# Altium project 28Pins_Project_V1I1.PrjPCB (part 1 of 3)
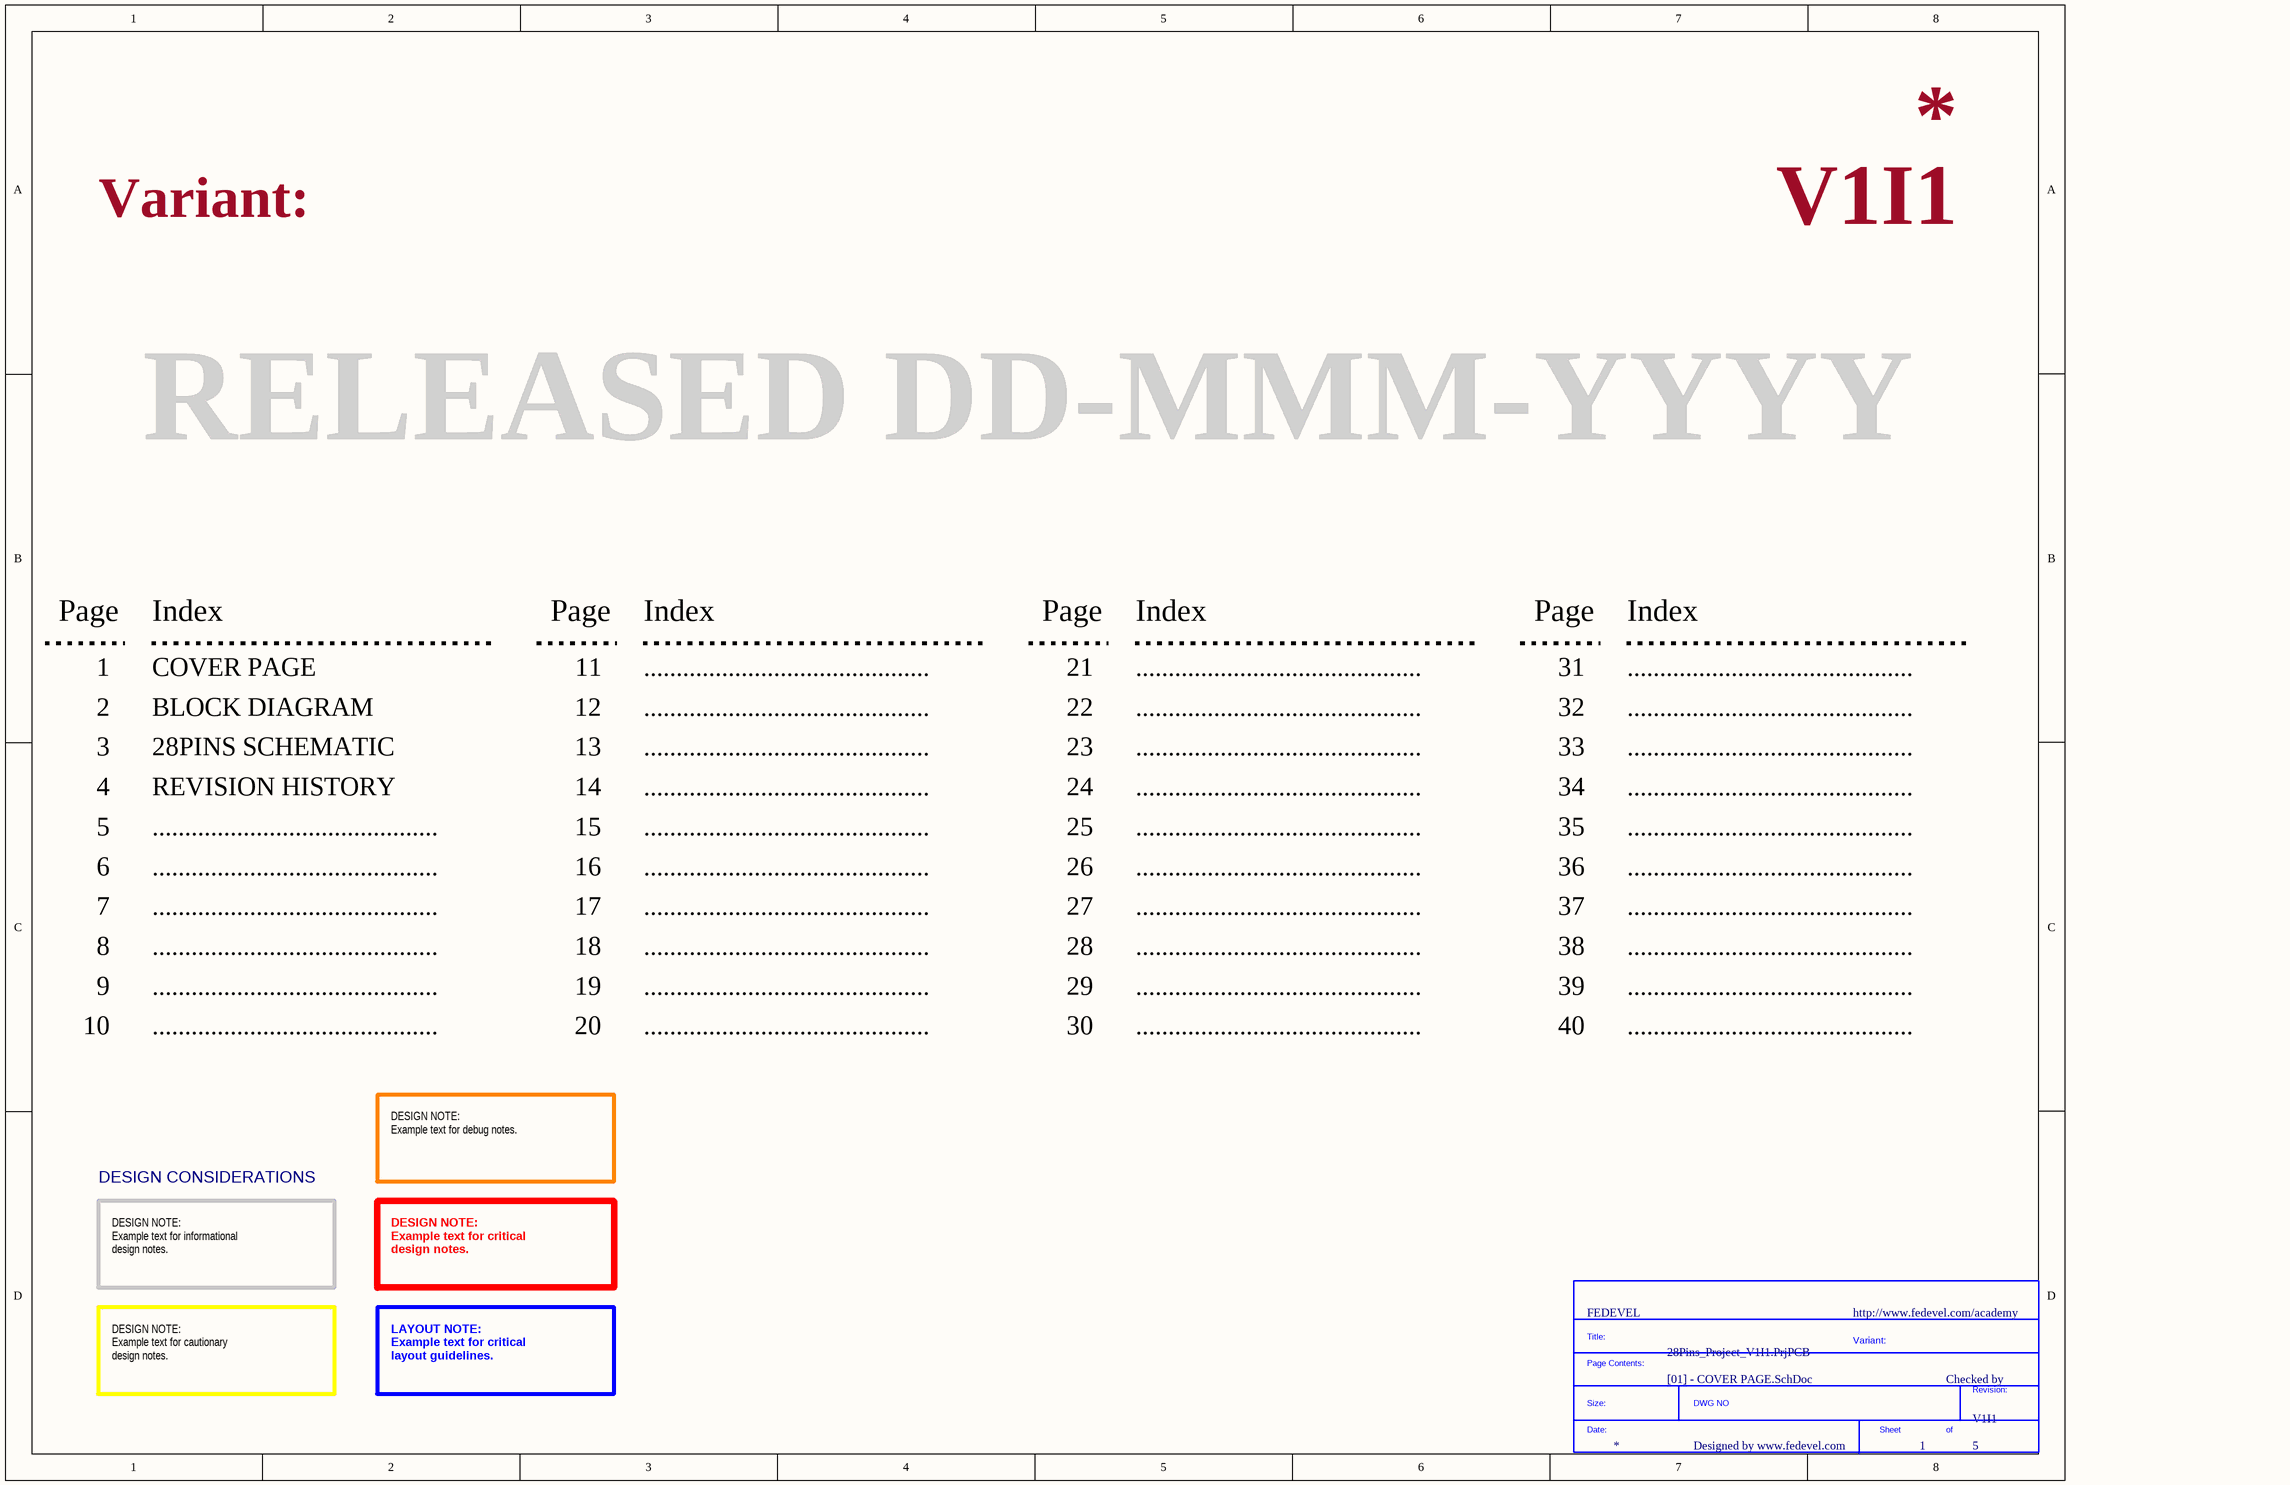
[diagram p0: [01] - COVER PAGE.SchDoc]
=CompanyName: FEDEVEL; NotFitted: NF; Title: 28Pins; VersionRevision: V1I1
4 sheets, 113 parts. Net scope: global (net labels, ports and power ports of the same name join across sheets).
Board file: 28Pins_Project_V1I1_PCB.PcbDoc
Sheets:
  [01] - COVER PAGE.SchDoc
  [02] - BLOCK DIAGRAM.SchDoc
  [03] - 28PINS SCHEMATIC.SchDoc
  [04] - REVISION HISTORY.SchDoc

## Sheet [01] - COVER PAGE.SchDoc: 28Pins
size A3; DocumentNumber: 1; SheetNumber: 1; SheetTotal: 5

### Parts
(Parts that share a designator on the sheet are numbered #1, #2 ... from top to bottom, then left to right.)
*#1  SDTitleBlock  (value not drawn)  (graphical)

### Notes on the sheet
- Variant:
- RELEASED DD-MMM-YYYY
- Page
- Index
- 1
- COVER PAGE
- 11
- ............................................
- 21
- 31
- 2
- 3
- BLOCK DIAGRAM
- 28PINS SCHEMATIC
- 12
- 13
- 22
- 23
- 32
- 33
- 4
- 5
- REVISION HISTORY
- 14
- 15
- 24
- 25
- 34
- 35
- 6
- 16
- 26
- 36
- 7
- 8
- 17
- 18
- 27
- 28
- 37
- 38
- 9
- 10
- 19
- 20
- 29
- 30
- 39
- 40
- DESIGN NOTE:
  Example text for debug notes.
- DESIGN CONSIDERATIONS
- DESIGN NOTE:
  Example text for informational
  design notes.
- DESIGN NOTE:
  Example text for critical
  design notes.
- http://www.fedevel.com/academy
- DESIGN NOTE:
  Example text for cautionary
  design notes.
- LAYOUT NOTE:
  Example text for critical
  layout guidelines.
- Checked by
- Designed by www.fedevel.com
- (in symbol SDTitleBlock) Title:; Page Contents:; Revision:; Size:; DWG NO; Date:; Sheet; of

## Sheet [02] - BLOCK DIAGRAM.SchDoc: 28Pins
size A3; DocumentNumber: 2; SheetNumber: 2; SheetTotal: 5; PageSetup: Record=PageOptions|CenterHorizontal=True|CenterVertical=True|PrintScale=0.52|XCorrection=1.00|YCorrection=1.00|PrintKind=1|BorderSize=5000000|LeftOffset=0|BottomOffset=0|Orientation=2|PaperLength=1000|PaperWidth=1000|Scale=100|PaperSource=4|PrintQuality=600|MediaType=1|DitherType=10|PrintScaleMode=1|PaperKind=A4|PaperIndex=9
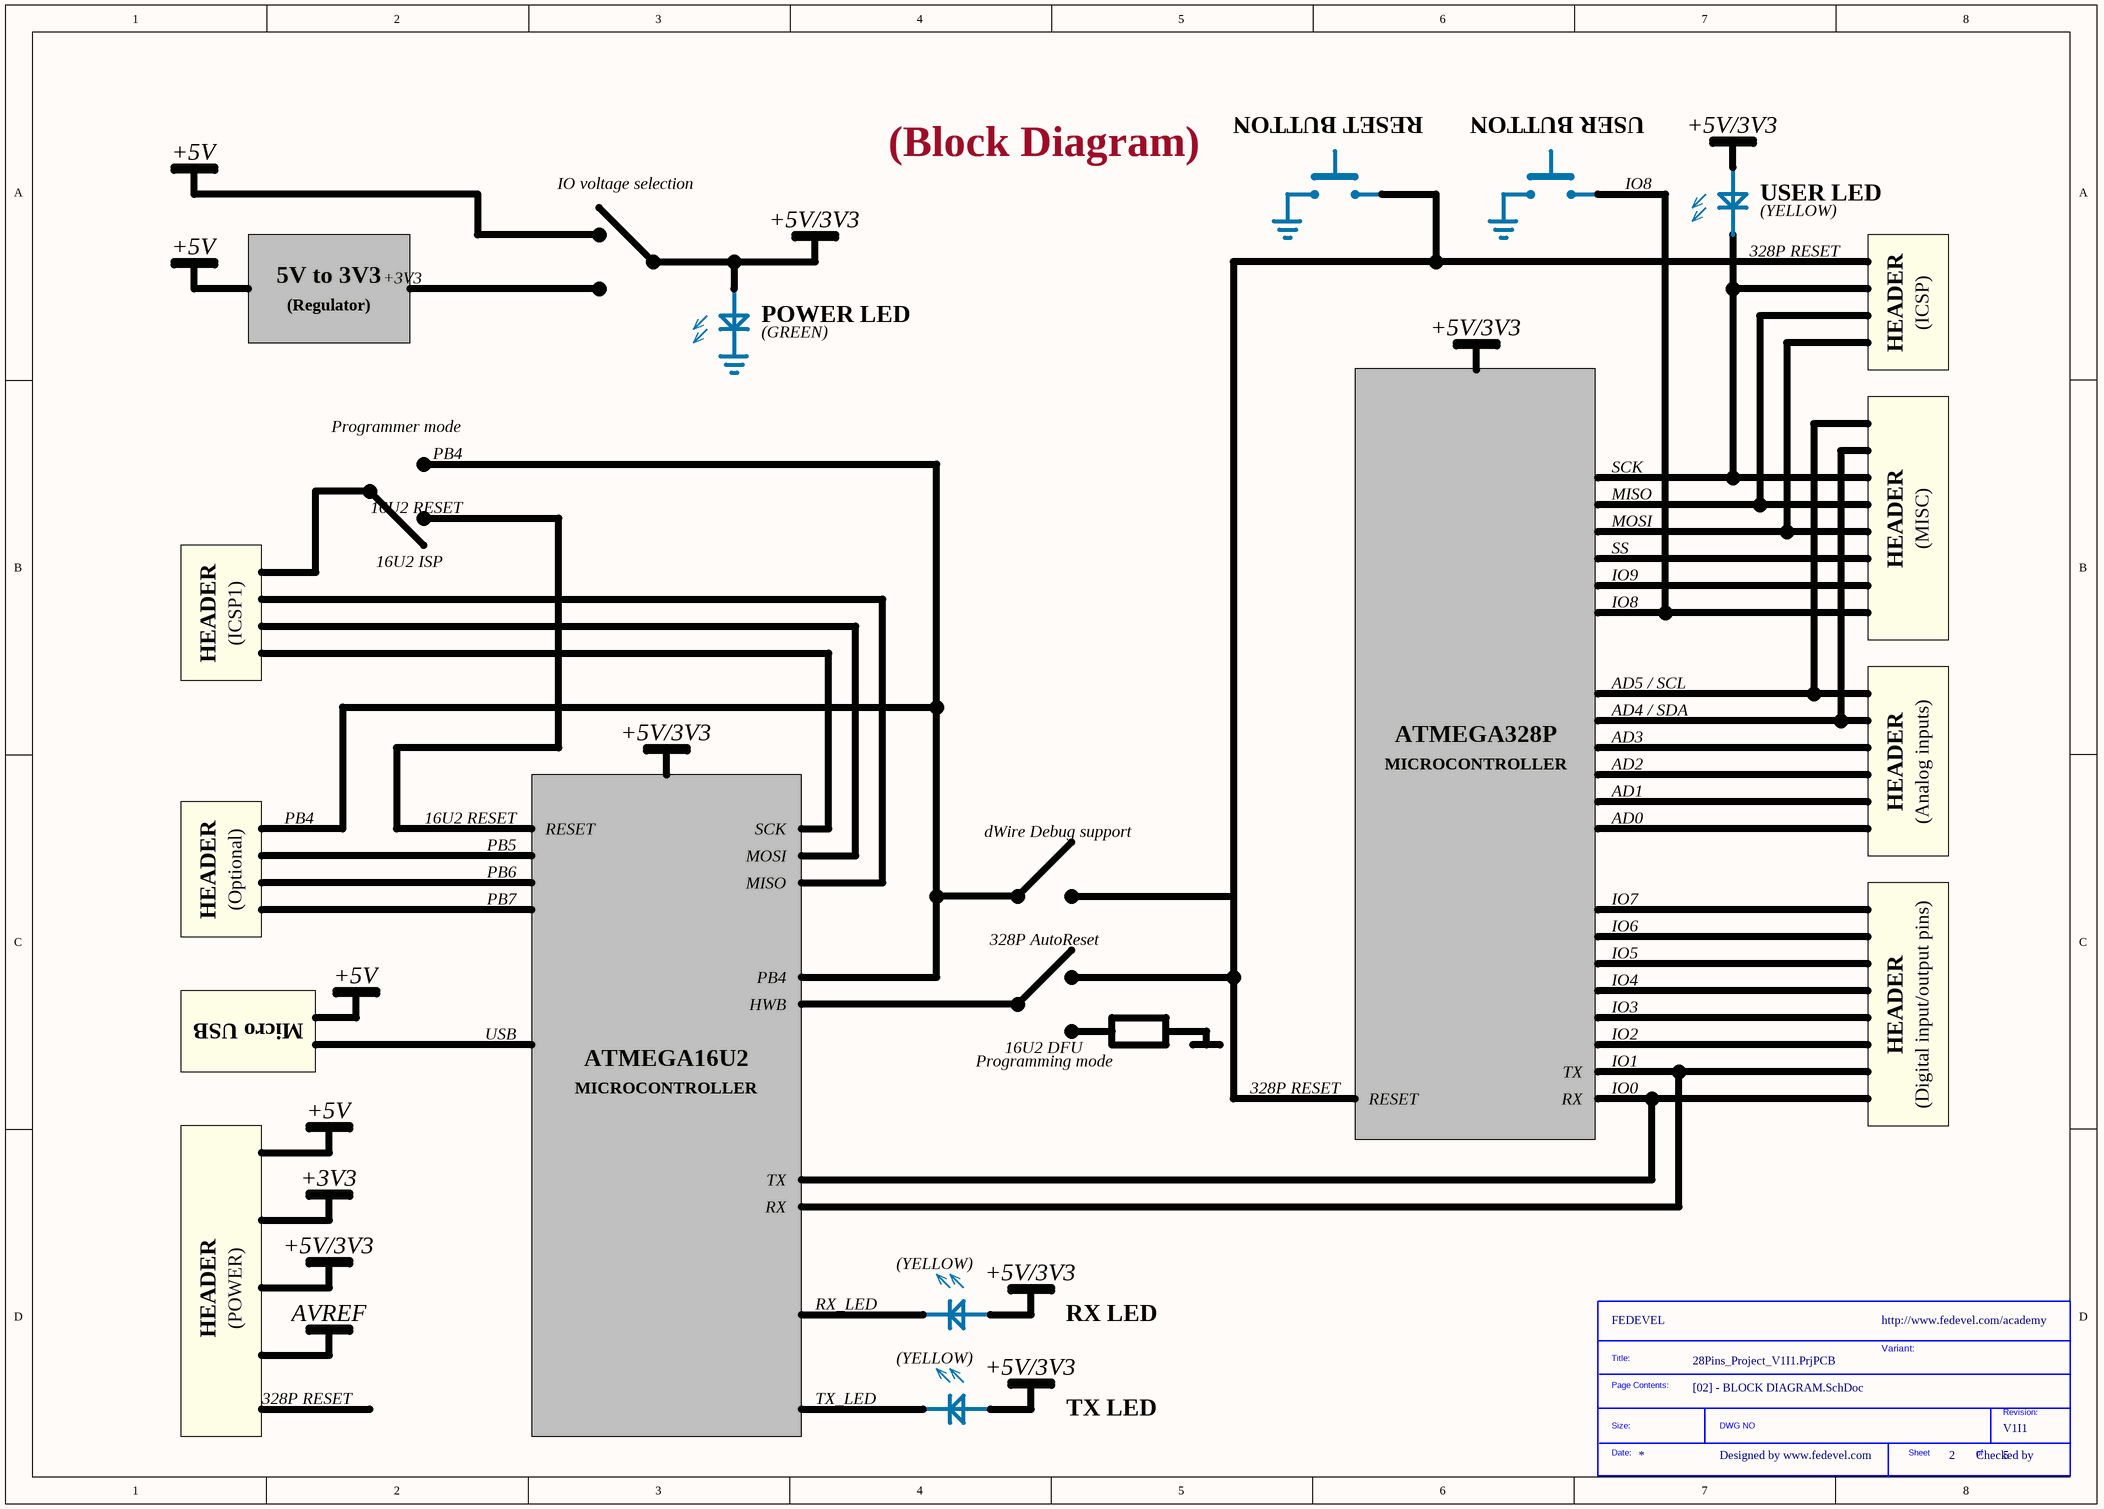
[diagram p1: [02] - BLOCK DIAGRAM.SchDoc]

### Parts
(Parts that share a designator on the sheet are numbered #1, #2 ... from top to bottom, then left to right.)
*#2  SDTitleBlock  (value not drawn)  (graphical)

### Notes on the sheet
- +5V
- (Block Diagram)
- RESET BUTTON
- USER BUTTON
- +5V/3V3
- IO voltage selection
- IO8
- USER LED
- (YELLOW)
- 5V to 3V3
- (Regulator)
- +3V3
- 328P RESET
- HEADER
- (ICSP)
- POWER LED
- (GREEN)
- Programmer mode
- PB4
- 16U2 RESET
- MISO
- SCK
- (MISC)
- 16U2 ISP
- SS
- IO9
- MOSI
- (ICSP1)
- AD5 / SCL
- AD4 / SDA
- ATMEGA328P
- MICROCONTROLLER
- AD3
- AD2
- (Analog inputs)
- PB5
- RESET
- dWire Debug support
- AD1
- AD0
- (Optional)
- PB6
- PB7
- IO7
- 328P AutoReset
- IO6
- IO5
- IO4
- Micro USB
- USB
- ATMEGA16U2
- HWB
- 16U2 DFU
- IO3
- IO2
- (Digital input/output pins)
- Programming mode
- RX
- TX
- IO1
- IO0
- (POWER)
- AVREF
- RX_LED
- RX LED
- http://www.fedevel.com/academy
- Variant:
- TX_LED
- TX LED
- Designed by www.fedevel.com
- Checked by
- (in symbol SDTitleBlock) Title:; Page Contents:; Revision:; Size:; DWG NO; Date:; Sheet; of

## Sheet [03] - 28PINS SCHEMATIC.SchDoc: 28Pins
size A2; DocumentNumber: 3; SheetNumber: 3; SheetTotal: 5
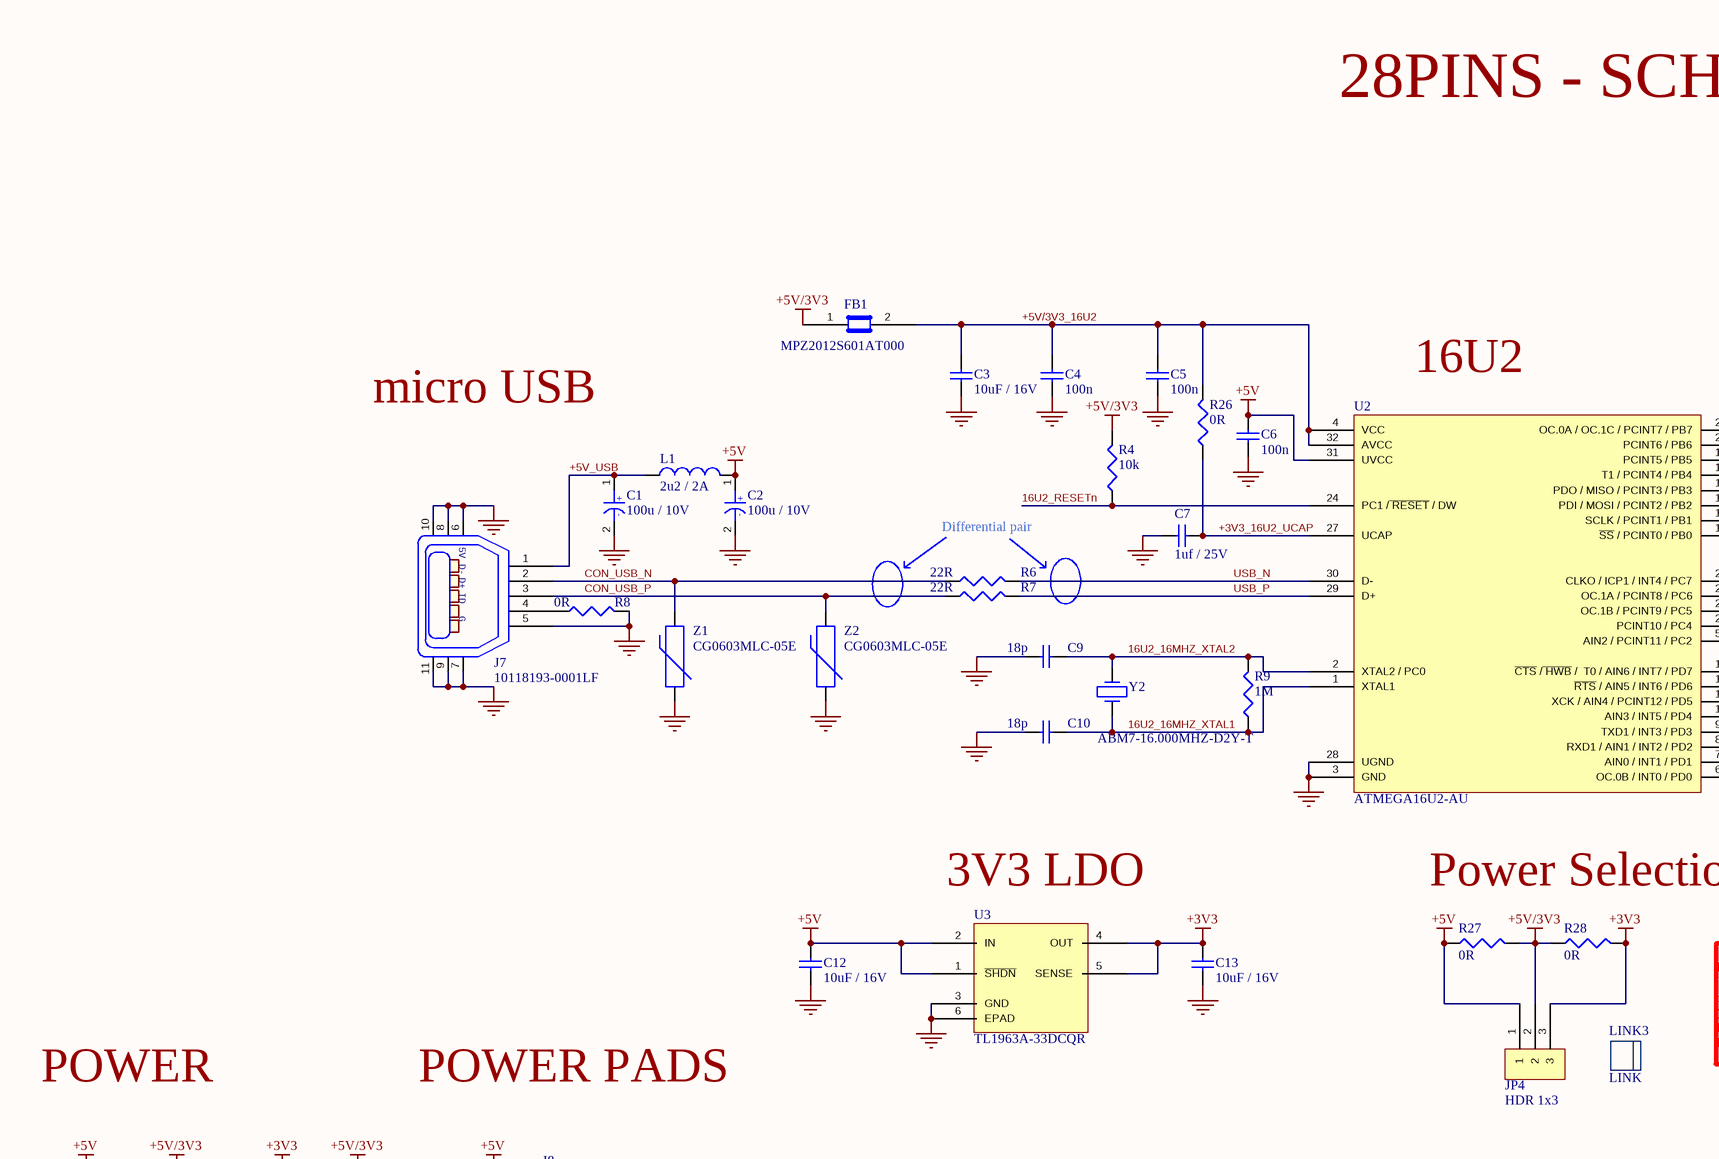
[diagram p2: [03] - 28PINS SCHEMATIC.SchDoc, top left]
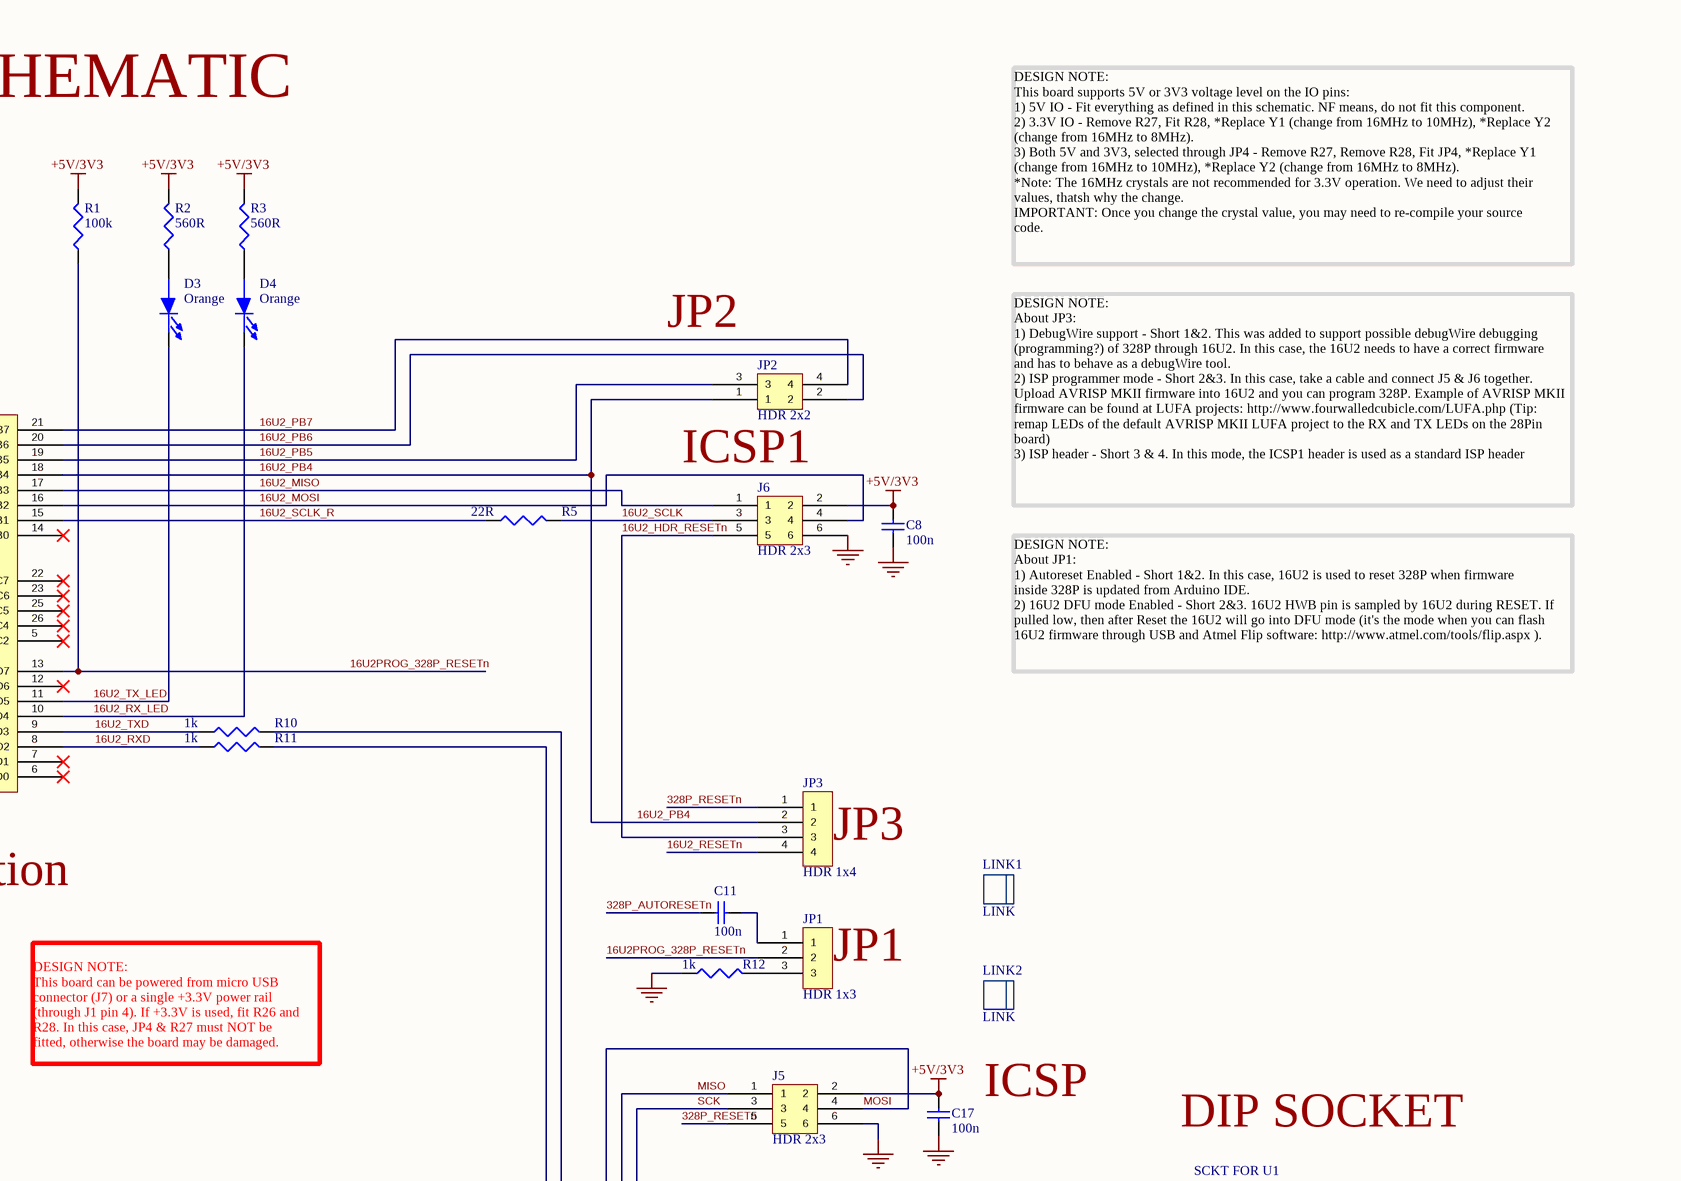
[diagram p3: [03] - 28PINS SCHEMATIC.SchDoc, top right]
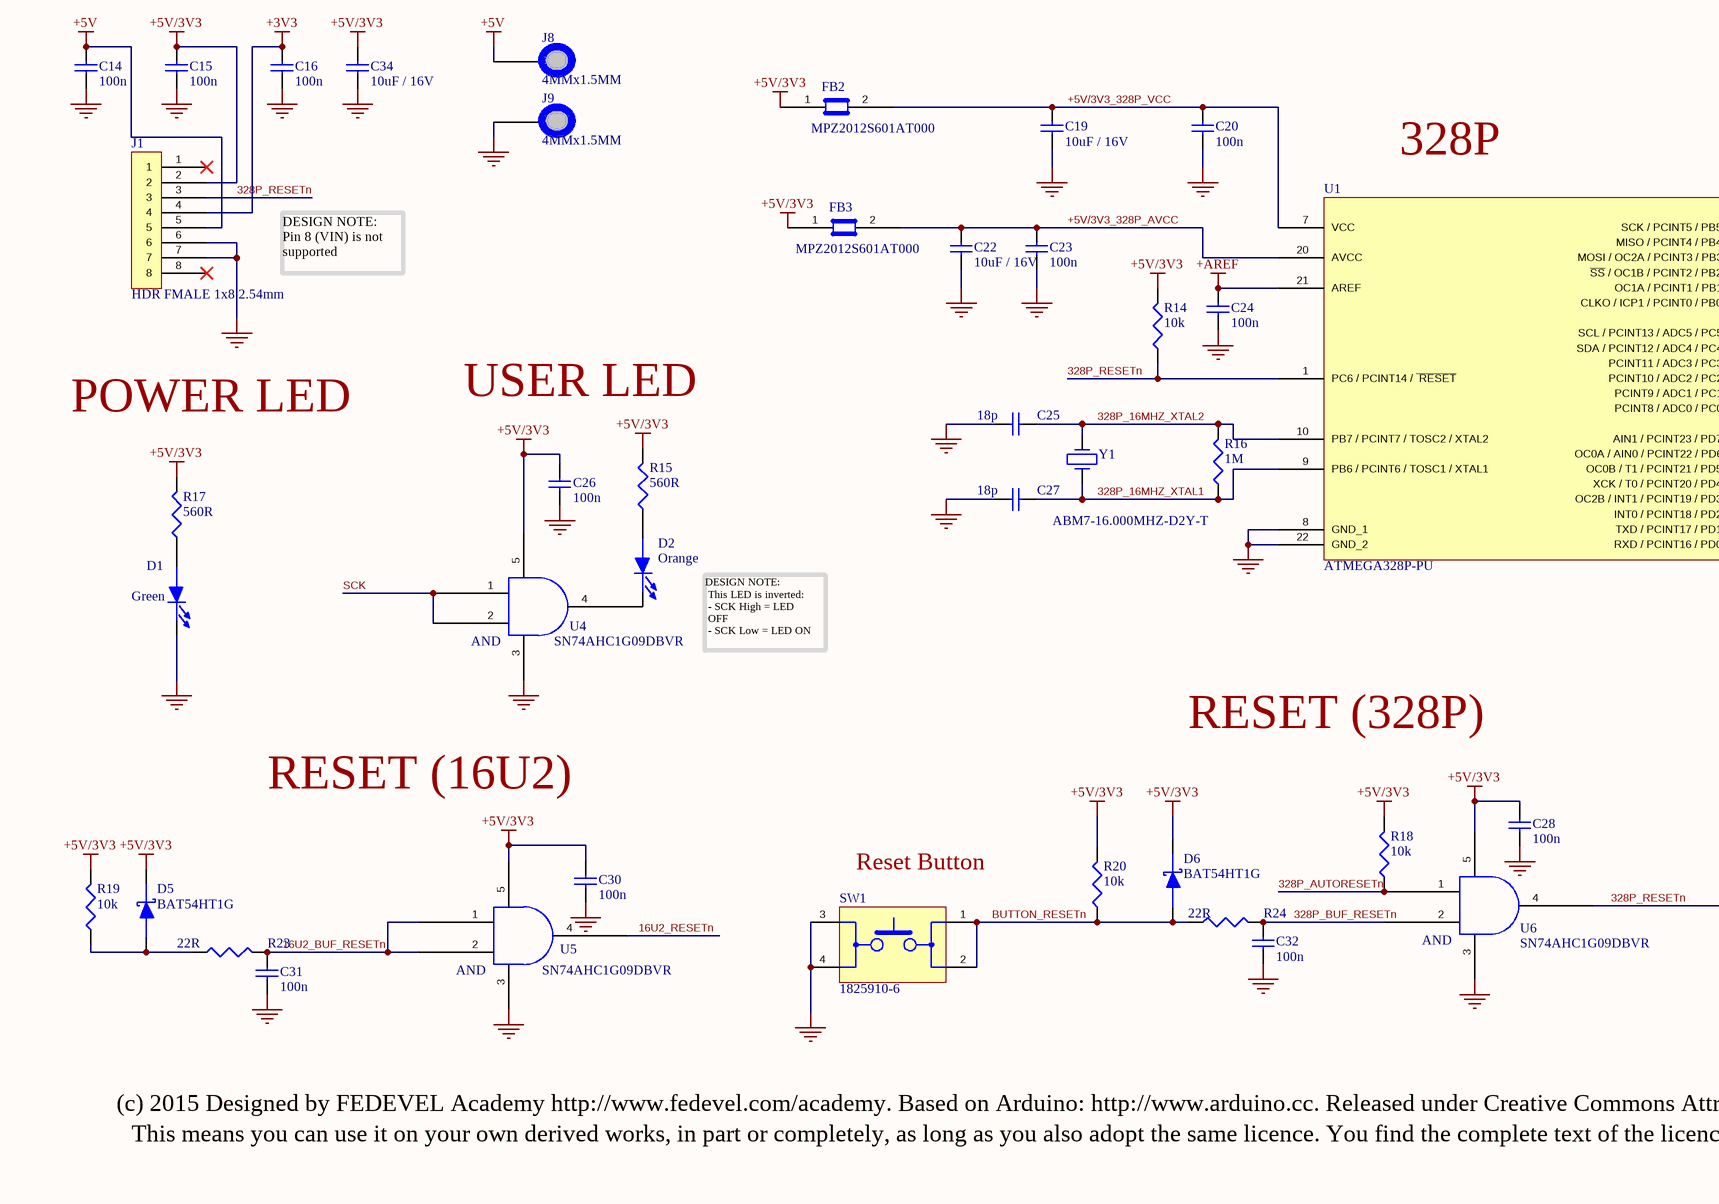
[diagram p4: [03] - 28PINS SCHEMATIC.SchDoc, bottom left]
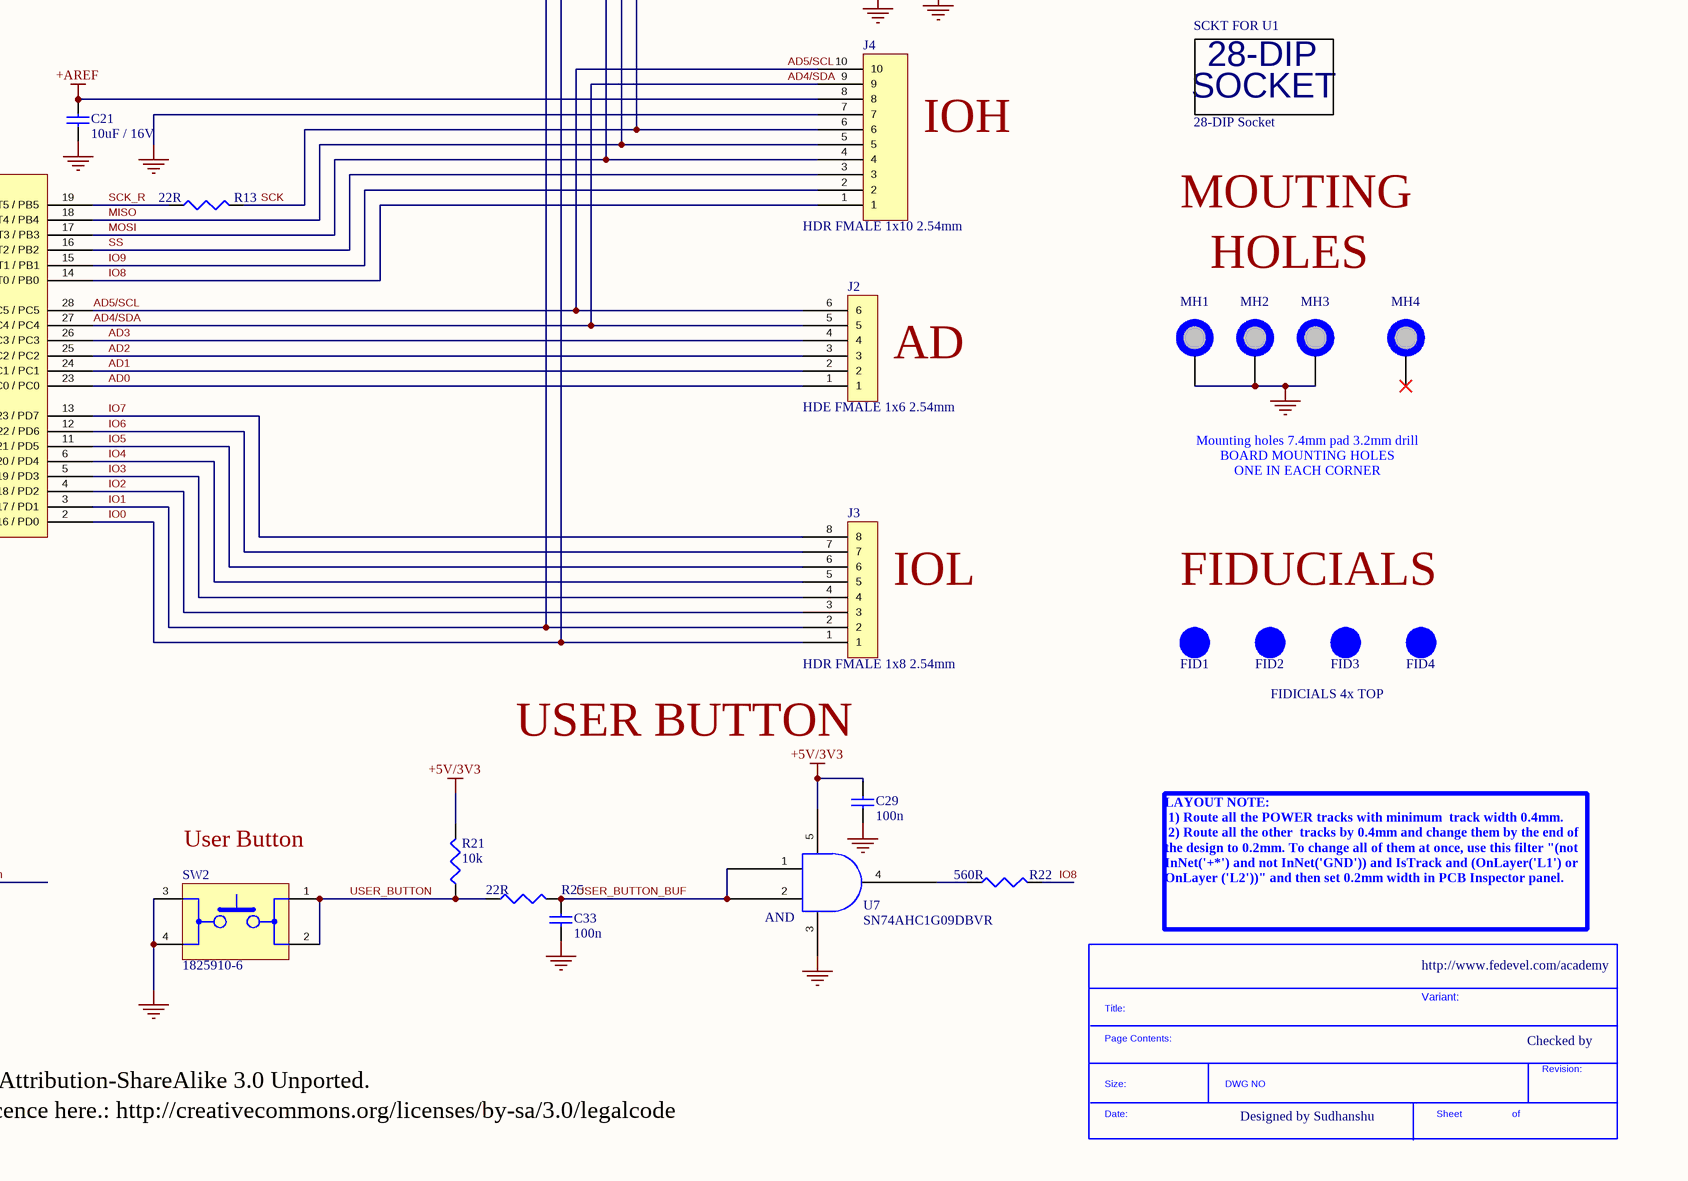
[diagram p5: [03] - 28PINS SCHEMATIC.SchDoc, bottom right]

### Parts
*?  SDTitleBlock  (value not drawn)  (graphical)
C1  100u / 10V  [C_ALU_C_SIZE]
C2  100u / 10V  [C_ALU_C_SIZE]
C3  10uF / 16V  [C0805 - 10uf]
C4  100n  [C0805]
C5  100n  [C0805]
C6  100n  [C0805]
C7  1uf / 25V  [C0805]
C8  100n  [C0805]
C9  18p  [C0805]
C10  18p  [C0805]
C11  100n  [C0805]
C12  10uF / 16V  [C0805 - 10uf]
C13  10uF / 16V  [C0805 - 10uf]
C14  100n  [C0805]
C15  100n  [C0805]
C16  100n  [C0805]
C17  100n  [C0805]
C19  10uF / 16V  [C0805 - 10uf]
C20  100n  [C0805]
C21  10uF / 16V  [C0805 - 10uf]
C22  10uF / 16V  [C0805 - 10uf]
C23  100n  [C0805]
C24  100n  [C0805]
C25  18p  [C0805]
C26  100n  [C0805]
C27  18p  [C0805]
C28  100n  [C0805]
C29  100n  [C0805]
C30  100n  [C0805]
C31  100n  [C0805]
C32  100n  [C0805]
C33  100n  [C0805]
C34  10uF / 16V  [C0805 - 10uf]
D1  Green  [LED_0603]
D2  Orange  [LED_0603]
D3  Orange  [LED_0603]
D4  Orange  [LED_0603]
D5  BAT54HT1G  [SOD323]
D6  BAT54HT1G  [SOD323]
FB1  MPZ2012S601AT000  [C0805]
FB2  MPZ2012S601AT000  [C0805]
FB3  MPZ2012S601AT000  [C0805]
FID1  FID_1MMC  [FID_40x120D]  (value not drawn)  (no BOM)
FID2  FID_1MMC  [FID_40x120D]  (value not drawn)  (no BOM)
FID3  FID_1MMC  [FID_40x120D]  (value not drawn)  (no BOM)
FID4  FID_1MMC  [FID_40x120D]  (value not drawn)  (no BOM)
J1  HDR FMALE 1x8 2.54mm  [HDR FMALE 1x8 2.54mm]
J2  HDE FMALE 1x6 2.54mm  [HDR FMALE 1x6 2.54mm]
J3  HDR FMALE 1x8 2.54mm  [HDR FMALE 1x8 2.54mm]
J4  HDR FMALE 1x10 2.54mm  [HDR FMALE 1x10 2.54mm]
J5  HDR 2x3  [HDR_2x3_2.54mm]
J6  HDR 2x3  [HDR_2x3_2.54mm]
J7  10118193-0001LF  [10118193]
J8  4MMx1.5MM  [PAD_WITH_HOLE_4MMx1.5MM]  (no BOM)
J9  4MMx1.5MM  [PAD_WITH_HOLE_4MMx1.5MM]  (no BOM)
JP1  HDR 1x3  [HDR FMALE 1x3 2.54mm]
JP2  HDR 2x2  [HDR_2x2_2.54mm]
JP3  HDR 1x4  [HDR_1x4_2.54mm]
JP4  HDR 1x3  [HDR FMALE 1x3 2.54mm]
L1  2u2 / 2A  [C1210_IND]
LINK1  LINK  (mechanical)
LINK2  LINK  (mechanical)
LINK3  LINK  (mechanical)
MH1  MH_7.4MMC_3.2MMD  [MH_7.4MMC_3.2MMD]  (value not drawn)  (no BOM)
MH2  MH_7.4MMC_3.2MMD  [MH_7.4MMC_3.2MMD]  (value not drawn)  (no BOM)
MH3  MH_7.4MMC_3.2MMD  [MH_7.4MMC_3.2MMD]  (value not drawn)  (no BOM)
MH4  MH_7.4MMNC_3.2MMD  [MH_7.4MMNC_3.2MMD_NON_COPPER_NPTH]  (value not drawn)  (no BOM)
R1  100k  [R0805]
R2  560R  [R0805]
R3  560R  [R0805]
R4  10k  [R0805]
R5  22R  [R0805]
R6  22R  [R0805]
R7  22R  [R0805]
R8  0R  [R0805]
R9  1M  [R0805]
R10  1k  [R0805]
R11  1k  [R0805]
R12  1k  [R0805]
R13  22R  [R0805]
R14  10k  [R0805]
R15  560R  [R0805]
R16  1M  [R0805]
R17  560R  [R0805]
R18  10k  [R0805]
R19  10k  [R0805]
R20  10k  [R0805]
R21  10k  [R0805]
R22  560R  [R0805]
R23  22R  [R0805]
R24  22R  [R0805]
R25  22R  [R0805]
R26  0R  [R0805]
R27  0R  [R0805]
R28  0R  [R0805]
SCKT_FOR_U1  28-DIP Socket  [28_DIP_7.62mm_SOCKET]
SW1  1825910-6  [1825910-6]
SW2  1825910-6  [1825910-6]
U1  ATMEGA328P-PU  [28_DIP_7.62MM]
U2  ATMEGA16U2-AU  [TQFP32]
U3  TL1963A-33DCQR  [DCQ (R-PDSO-G6)]
U4  SN74AHC1G09DBVR  [DBV_SOT_23_5]
U5  SN74AHC1G09DBVR  [DBV_SOT_23_5]
U6  SN74AHC1G09DBVR  [DBV_SOT_23_5]
U7  SN74AHC1G09DBVR  [DBV_SOT_23_5]
Y1  ABM7-16.000MHZ-D2Y-T  [ABM7_v1_1_BIG]
Y2  ABM7-16.000MHZ-D2Y-T  [ABM7_v1_1_BIG]
Z1  CG0603MLC-05E  [R0603]
Z2  CG0603MLC-05E  [R0603]

### Nets
+3V3: C13.2 C16.2 J1.4 JP4.3 R28.2 U3.4(OUT) U3.5(SENSE)
+5V: C2.1 C6.2 C12.2 C14.2 J1.5 J8.1 JP4.1 L1.2 R27.1 U2.31(UVCC) U3.1(~{SHDN}) U3.2(IN)
+5V/3V3: C8.2 C15.2 C17.2 C26.2 C28.2 C29.2 C30.2 C34.2 D5.1(Cathode) D6.1(Cathode) FB1.1 FB2.1 FB3.1 J1.2 J5.2 J6.2 JP4.2 R1.2 R2.2 R3.2 R4.2 R14.2 R15.2 R17.2 R18.2 R19.2 R20.2 R21.2 R27.2 R28.1 U4.5 U5.5 U6.5 U7.5
+AREF: C21.2 C24.2 J4.8 U1.21(AREF)
GND: C1.2 C2.2 C3.1 C4.1 C5.1 C6.1 C7.1 C8.1 C9.1 C10.1 C12.1 C13.1 C14.1 C15.1 C16.1 C17.1 C19.1 C20.1 C21.1 C22.1 C23.1 C24.1 C25.1 C26.1 C27.1 C28.1 C29.1 C30.1 C31.1 C32.1 C33.1 C34.1 D1.1(Cathode) J1.6 J1.7 J4.7 J5.6 J6.6 J7.5 J7.6 J7.7 J7.8 J7.9 J7.10 J7.11 J9.1 MH1.1 MH2.1 MH3.1 R8.2 R12.1 SW1.3 SW1.4 SW2.3 SW2.4 U1.8(GND_1) U1.22(GND_2) U2.3(GND) U2.28(UGND) U3.3(GND) U3.6(EPAD) U4.3 U5.3 U6.3 U7.3 Z1.1 Z2.1
16U2_16MHZ_XTAL1: C10.2 R9.1 U2.1(XTAL1) Y2.1
16U2_16MHZ_XTAL2: C9.2 R9.2 U2.2(XTAL2_/_PC0) Y2.2
16U2_BUF_RESETn: C31.2 R23.2 U5.1 U5.2
16U2_HDR_RESETn: J6.5 JP3.3
16U2_MISO: J6.1 U2.17(PDO_/_MISO_/_PCINT3_/_PB3)
16U2_MOSI: J6.4 U2.16(PDI_/_MOSI_/_PCINT2_/_PB2)
16U2_PB4: JP2.1 JP3.2 U2.18(T1_/_PCINT4_/_PB4)
16U2_PB5: JP2.3 U2.19(PCINT5_/_PB5)
16U2_PB6: JP2.2 U2.20(PCINT6_/_PB6)
16U2_PB7: JP2.4 U2.21(OC.0A_/_OC.1C_/_PCINT7_/_PB7)
16U2_RESETn: JP3.4 R4.1 U2.24(PC1_/~{_RESET}_/_DW) U5.4
16U2_RX_LED: D4.1(Cathode) U2.10(AIN3_/_INT5_/_PD4)
16U2_RXD: R11.1 U2.8(RXD1_/_AIN1_/_INT2_/_PD2)
16U2_SCLK: J6.3 R5.2
16U2_SCLK_R: R5.1 U2.15(SCLK_/_PCINT1_/_PB1)
16U2_TX_LED: D3.1(Cathode) U2.11(XCK_/_AIN4_/_PCINT12_/_PD5)
16U2_TXD: R10.1 U2.9(TXD1_/_INT3_/_PD3)
16U2PROG_328P_RESETn: JP1.2 R1.1 U2.13(~{CTS}_/~{_HWB}_/__T0_/_AIN6_/_INT7_/_PD7)
328P_16MHZ_XTAL1: C27.2 R16.1 U1.9(PB6_/_PCINT6_/_TOSC1_/_XTAL1) Y1.1
328P_16MHZ_XTAL2: C25.2 R16.2 U1.10(PB7_/_PCINT7_/_TOSC2_/_XTAL2) Y1.2
328P_AUTORESETn: C11.1 R18.1 U6.1
328P_BUF_RESETn: C32.2 R24.2 U6.2
328P_RESETn: J1.3 J5.5 JP3.1 R14.1 U1.1(PC6_/_PCINT14_/_~{_RESET}) U6.4
+3V3_16U2_UCAP: C7.2 R26.1 U2.27(UCAP)
+5V/3V3_16U2: C3.2 C4.2 C5.2 FB1.2 R26.2 U2.4(VCC) U2.32(AVCC)
+5V/3V3_328P_AVCC: C22.2 C23.2 FB3.2 U1.20(AVCC)
+5V/3V3_328P_VCC: C19.2 C20.2 FB2.2 U1.7(VCC)
+5V_USB: C1.1 J7.1 L1.1
AD0: J2.1 U1.23(PCINT8_/_ADC0_/_PC0)
AD1: J2.2 U1.24(PCINT9_/_ADC1_/_PC1)
AD2: J2.3 U1.25(PCINT10_/_ADC2_/_PC2)
AD3: J2.4 U1.26(PCINT11_/_ADC3_/_PC3)
AD4/SDA: J2.5 J4.9 U1.27(SDA_/_PCINT12_/_ADC4_/_PC4)
AD5/SCL: J2.6 J4.10 U1.28(SCL_/_PCINT13_/_ADC5_/_PC5)
BUTTON_RESETn: D6.2(Anode) R20.1 R24.1 SW1.1 SW1.2
CON_USB_N: J7.2 R6.1 Z1.2
CON_USB_P: J7.3 R7.1 Z2.2
IO0: J3.1 R10.2 U1.2(RXD_/_PCINT16_/_PD0)
IO1: J3.2 R11.2 U1.3(TXD_/_PCINT17_/_PD1)
IO2: J3.3 U1.4(INT0_/_PCINT18_/_PD2)
IO3: J3.4 U1.5(OC2B_/_INT1_/_PCINT19_/_PD3)
IO4: J3.5 U1.6(XCK_/_T0_/_PCINT20_/_PD4)
IO5: J3.6 U1.11(OC0B_/_T1_/_PCINT21_/_PD5)
IO6: J3.7 U1.12(OC0A_/_AIN0_/_PCINT22_/_PD6)
IO7: J3.8 U1.13(AIN1_/_PCINT23_/_PD7)
IO8: J4.1 R22.2 U1.14(CLKO_/_ICP1_/_PCINT0_/_PB0)
IO9: J4.2 U1.15(OC1A_/_PCINT1_/_PB1)
MISO: J4.5 J5.1 U1.18(MISO_/_PCINT4_/_PB4)
MOSI: J4.4 J5.4 U1.17(MOSI_/_OC2A_/_PCINT3_/_PB3)
SCK: J4.6 J5.3 R13.2 U4.1 U4.2
SCK_R: R13.1 U1.19(SCK_/_PCINT5_/_PB5)
SS: J4.3 U1.16(~{SS}_/_OC1B_/_PCINT2_/_PB2)
USB_N: R6.2 U2.30(D-)
USB_P: R7.2 U2.29(D+)
USER_BUTTON: R21.1 R25.1 SW2.1 SW2.2
USER_BUTTON_BUF: C33.2 R25.2 U7.1 U7.2
NetC11_2: C11.2 JP1.1
NetD1_2: D1.2(Anode) R17.1
NetD2_1: D2.1(Cathode) U4.4
NetD2_2: D2.2(Anode) R15.1
NetD3_2: D3.2(Anode) R2.1
NetD4_2: D4.2(Anode) R3.1
NetD5_2: D5.2(Anode) R19.1 R23.1
NetJ7_4: J7.4 R8.1
NetJP1_3: JP1.3 R12.2
NetR22_1: R22.1 U7.4

Not connected (* = marked no-connect by the designer): J1 1* 8*; MH4 1*; U2 5(AIN2_/_PCINT11_/_PC2)* 6(OC.0B_/_INT0_/_PD0)* 7(AIN0_/_INT1_/_PD1)* 12(~{RTS}_/_AIN5_/_INT6_/_PD6)* 14(~{SS}_/_PCINT0_/_PB0)* 22(CLKO_/_ICP1_/_INT4_/_PC7)* 23(OC.1A_/_PCINT8_/_PC6)* 25(OC.1B_/_PCINT9_/_PC5)* 26(PCINT10_/_PC4)*

### Notes on the sheet
- 28PINS - SCHEMATIC
- DESIGN NOTE:
  This board supports 5V or 3V3 voltage level on the IO pins:
  1) 5V IO - Fit everything as defined in this schematic. NF means, do not fit this component.
  2) 3.3V IO - Remove R27, Fit R28, *Replace Y1 (change from 16MHz to 10MHz), *Replace Y2
  (change from 16MHz to 8MHz).
  3) Both 5V and 3V3, selected through JP4 - Remove R27, Remove R28, Fit JP4, *Replace Y1
  (change from 16MHz to 10MHz), *Replace Y2 (change from 16MHz to 8MHz).
  *Note: The 16MHz crystals are not recommended for 3.3V operation. We need to adjust their
  values, thatsh why the change.
  IMPORTANT: Once you change the crystal value, you may need to re-compile your source
  code.
- (near U2) 16U2
- (near JP2) JP2
- micro USB
- ICSP1
- Differential pair
- DESIGN NOTE:
  About JP3:
  1) DebugWire support - Short 1&2. This was added to support possible debugWire debugging
  (programming?) of 328P through 16U2. In this case, the 16U2 needs to have a correct firmware
  and has to behave as a debugWire tool.
  2) ISP programmer mode - Short 2&3. In this case, take a cable and connect J5 & J6 together.
  Upload AVRISP MKII firmware into 16U2 and you can program 328P. Example of AVRISP MKII
  firmware can be found at LUFA projects: http://www.fourwalledcubicle.com/LUFA.php (Tip:
  remap LEDs of the default AVRISP MKII LUFA project to the RX and TX LEDs on the 28Pin
  board)
  3) ISP header - Short 3 & 4. In this mode, the ICSP1 header is used as a standard ISP header
- DESIGN NOTE:
  About JP1:
  1) Autoreset Enabled - Short 1&2. In this case, 16U2 is used to reset 328P when firmware
  inside 328P is updated from Arduino IDE.
  2) 16U2 DFU mode Enabled - Short 2&3. 16U2 HWB pin is sampled by 16U2 during RESET. If
  pulled low, then after Reset the 16U2 will go into DFU mode (it's the mode when you can flash
  16U2 firmware through USB and Atmel Flip software: http://www.atmel.com/tools/flip.aspx ).
- (near JP3) JP3
- (near U3) 3V3 LDO
- Power Selection
- (near JP1) JP1
- DESIGN NOTE:
  This board can be powered from micro USB
  connector (J7) or a single +3.3V power rail
  (through J1 pin 4). If +3.3V is used, fit R26 and
  R28. In this case, JP4 & R27 must NOT be
  fitted, otherwise the board may be damaged.
- POWER
- POWER PADS
- ICSP
- DIP SOCKET
- 328P
- IOH
- MOUTING
- DESIGN NOTE:
  Pin 8 (VIN) is not
  supported
- HOLES
- USER LED
- (near J2) AD
- POWER LED
- Mounting holes 7.4mm pad 3.2mm drill         BOARD MOUNTING HOLES
  ONE IN EACH CORNER
- (near J3) IOL
- FIDUCIALS
- DESIGN NOTE:
  This LED is inverted:
  - SCK High = LED
  OFF
  - SCK Low = LED ON
- RESET (328P)
- USER BUTTON
- FIDICIALS 4x TOP
- RESET (16U2)
- (near SW1) Reset Button
- (near SW2) User Button
- LAYOUT NOTE:
  1) Route all the POWER tracks with minimum  track width 0.4mm.
  2) Route all the other  tracks by 0.4mm and change them by the end of the design to 0.2mm. To change all of them at once, use this filter "(not InNet('+*') and not InNet('GND')) and IsTrack and (OnLayer('L1') or OnLayer ('L2'))" and then set 0.2mm width in PCB Inspector panel.
- http://www.fedevel.com/academy
- Variant:
- Checked by
- (c) 2015 Designed by FEDEVEL Academy http://www.fedevel.com/academy. Based on Arduino: http://www.arduino.cc. Released under Creative Commons Attribution-ShareAlike 3.0 Unported.
- This means you can use it on your own derived works, in part or completely, as long as you also adopt the same licence. You find the complete text of the licence here.: http://creativecommons.org/licenses/by-sa/3.0/legalcode
- Designed by Sudhanshu
- (in symbol 4828-3004-CP) 28-DIP; SOCKET
- (in symbol 10118193-0001LF) 5V; D-; D+; ID; G
- (in symbol EEE-1AA101WR) +; -
- (in symbol SDTitleBlock) Title:; Page Contents:; Revision:; Size:; DWG NO; Date:; Sheet; of